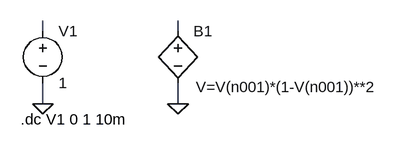
[diagram p0: schematic Func1.asc]
Func1.asc, the LTspice schematic file:
Version 4
SHEET 1 880 680
WIRE 80 112 80 96
WIRE 288 112 288 96
WIRE 80 224 80 192
WIRE 288 224 288 192
FLAG 80 224 0
FLAG 288 224 0
SYMBOL voltage 80 96 R0
WINDOW 123 0 0 Left 0
WINDOW 39 0 0 Left 0
SYMATTR InstName V1
SYMATTR Value 1
SYMBOL bv 288 96 R0
WINDOW 3 28 102 Left 0
SYMATTR InstName B1
SYMATTR Value V=V(n001)*(1-V(n001))**2
TEXT 46 248 Left 0 !.dc V1 0 1 10m

The netlist it stands for:
* Func1.asc
V1 N001 0 1
B1 N002 0 V=V(n001)*(1-V(n001))**2
.dc V1 0 1 10m
.backanno
.end